# Altium schematic sheet ATMega1284p.SchDoc
size A; SheetNumber: 3; SheetTotal: 7
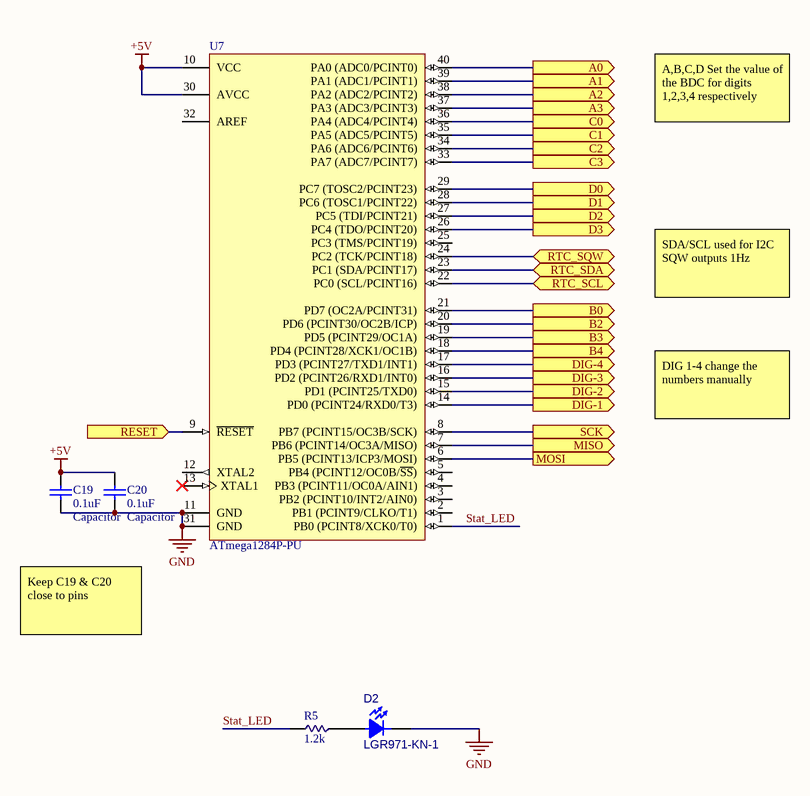
[diagram p0: ATMega1284p.SchDoc]

## Parts
C19  value 0.1uF  Type: Capacitor  [FOOTPRINT-1206-GEN]  (hidden comment: Capacitor - 0.1uF - 1206)
C20  value 0.1uF  Type: Capacitor  [FOOTPRINT-1206-GEN]  (hidden comment: Capacitor - 0.1uF - 1206)
D2  LGR971-KN-1  [FOOTPRINT-OSRAM-CHIPLED-0805-1A2K]
R5  value 1.2k  [FOOTPRINT-0805-GEN]  (hidden comment: RMCF0805FT1K20)
U7  ATmega1284P-PU  [40P6]

## Ports
A0 (out), A1 (out), A2 (out), A3 (out), B0 (out), B2 (out), B3 (out), B4 (out), C0 (out), C1 (out), C2 (out), C3 (out), D0 (out), D1 (out), D2 (out), D3 (out), DIG-1 (out), DIG-2 (out), DIG-3 (out), DIG-4 (out), MISO (out), MOSI (out), RESET (in), RTC_SCL (bidir), RTC_SDA (bidir), RTC_SQW (bidir), SCK (out)

## Nets
+5V: C19.2 C20.2 U7.10(VCC) U7.30(AVCC)
GND: C19.1 C20.1 D2.2(K) U7.11(GND) U7.31(GND)
A0: U7.40(PA0_(ADC0/PCINT0)) ; port A0
A1: U7.39(PA1_(ADC1/PCINT1)) ; port A1
A2: U7.38(PA2_(ADC2/PCINT2)) ; port A2
A3: U7.37(PA3_(ADC3/PCINT3)) ; port A3
B0: U7.21(PD7_(OC2A/PCINT31)) ; port B0
B2: U7.20(PD6_(PCINT30/OC2B/ICP)) ; port B2
B3: U7.19(PD5_(PCINT29/OC1A)) ; port B3
B4: U7.18(PD4_(PCINT28/XCK1/OC1B)) ; port B4
C0: U7.36(PA4_(ADC4/PCINT4)) ; port C0
C1: U7.35(PA5_(ADC5/PCINT5)) ; port C1
C2: U7.34(PA6_(ADC6/PCINT6)) ; port C2
C3: U7.33(PA7_(ADC7/PCINT7)) ; port C3
D0: U7.29(PC7_(TOSC2/PCINT23)) ; port D0
D1: U7.28(PC6_(TOSC1/PCINT22)) ; port D1
D2: U7.27(PC5_(TDI/PCINT21)) ; port D2
D3: U7.26(PC4_(TDO/PCINT20)) ; port D3
DIG-1: U7.14(PD0_(PCINT24/RXD0/T3)) ; port DIG-1
DIG-2: U7.15(PD1_(PCINT25/TXD0)) ; port DIG-2
DIG-3: U7.16(PD2_(PCINT26/RXD1/INT0)) ; port DIG-3
DIG-4: U7.17(PD3_(PCINT27/TXD1/INT1)) ; port DIG-4
MISO: U7.7(PB6_(PCINT14/OC3A/MISO)) ; port MISO
MOSI: U7.6(PB5_(PCINT13/ICP3/MOSI)) ; port MOSI
RESET: U7.9(~{RESET}) ; port RESET
RTC_SCL: U7.22(PC0_(SCL/PCINT16)) ; port RTC_SCL
RTC_SDA: U7.23(PC1_(SDA/PCINT17)) ; port RTC_SDA
RTC_SQW: U7.24(PC2_(TCK/PCINT18)) ; port RTC_SQW
SCK: U7.8(PB7_(PCINT15/OC3B/SCK)) ; port SCK
Stat_LED: R5.2 U7.1(PB0_(PCINT8/XCK0/T0))
NetD2_1: D2.1(A) R5.1

Not connected (* = marked no-connect by the designer): U7 2(PB1_(PCINT9/CLKO/T1)) 3(PB2_(PCINT10/INT2/AIN0)) 4(PB3_(PCINT11/OC0A/AIN1)) 5(PB4_(PCINT12/OC0B/~{SS})) 12(XTAL2) 13(XTAL1)* 25(PC3_(TMS/PCINT19)) 32(AREF)

## Notes on the sheet
- A,B,C,D Set the value of the BDC for digits 1,2,3,4 respectively
- SDA/SCL used for I2C
  SQW outputs 1Hz
- DIG 1-4 change the numbers manually
- Keep C19 & C20 close to pins

## Library data of the parts
C19 C20 = CMP-001-00096-1: CAP CER 0.1UF 50V X7R 1206; Part Number: 1276-7034-1-ND; PackageReference: RAD-0.3; Published: 8-Jun-2000; Source: Generic.SchLib; Design Item ID: Capacitor-Generic-1206; LatestRevisionNote: Re-released for DXP Platform.; PackageDescription: Radial Cap, Thru-Hole; 2 Leads; 0.3 in Pin Spacing; Publisher: Altium Limited
D2 = CMP-017-000003-2: LED Uni-Color Green 572nm 2-Pin Chip 0805(2012Metric) T/R; Part Number: 475-1410-1-ND; Current - Maximum: 25mA; Current - Test: 20mA; Forward Voltage: 2.2V; Design Item ID: LED-OSRAM-LG-R971-KN-1; Source: Discrete.SchLib
R5 = CMP-009-00185-2: Res Thick Film 0805 1.2K Ohm 1% 0.125W ±100ppm/°C Molded SMD Paper T/R; Design Item ID: Resistor-Generic-0805-2012; Source: Generic.SchLib; Type: Resistor
U7 = CMP-0107-00007-2: 8-bit AVR Microcontroller, 128KB Flash, 4KB EEPROM, 16KB SRAM, 40-pin PDIP, Industrial Grade (-40°C to 85°C); ComponentLink2Description: ATmega164A/164PA/324A/324PA/644A/644PA/1284/1284P Datasheet; PackageReference: 40P6; PackageVersion: revB, Sep-2001; PackageDescription: 40-lead (0.600"/15.24mm Wide) Plastic Dual Inline Package (PDIP); Code_JEDEC: MS-011-AC; ComponentLink1Description: Manufacturer URL; ComponentLink3Description: ATmega164A/164PA/324A/324PA/644A/644PA/1284/1284P Summary; ComponentLink3URL: http://www.atmel.com/dyn/resources/prod_documents/8272S.pdf; DatasheetVersion: revC, Jun-2011; ComponentLink2URL: http://www.atmel.com/dyn/resources/prod_documents/doc8272.pdf; ComponentLink1URL: http://www.atmel.com/